# Altium schematic sheet Schematic_Rev3.1.SchDoc
size A3
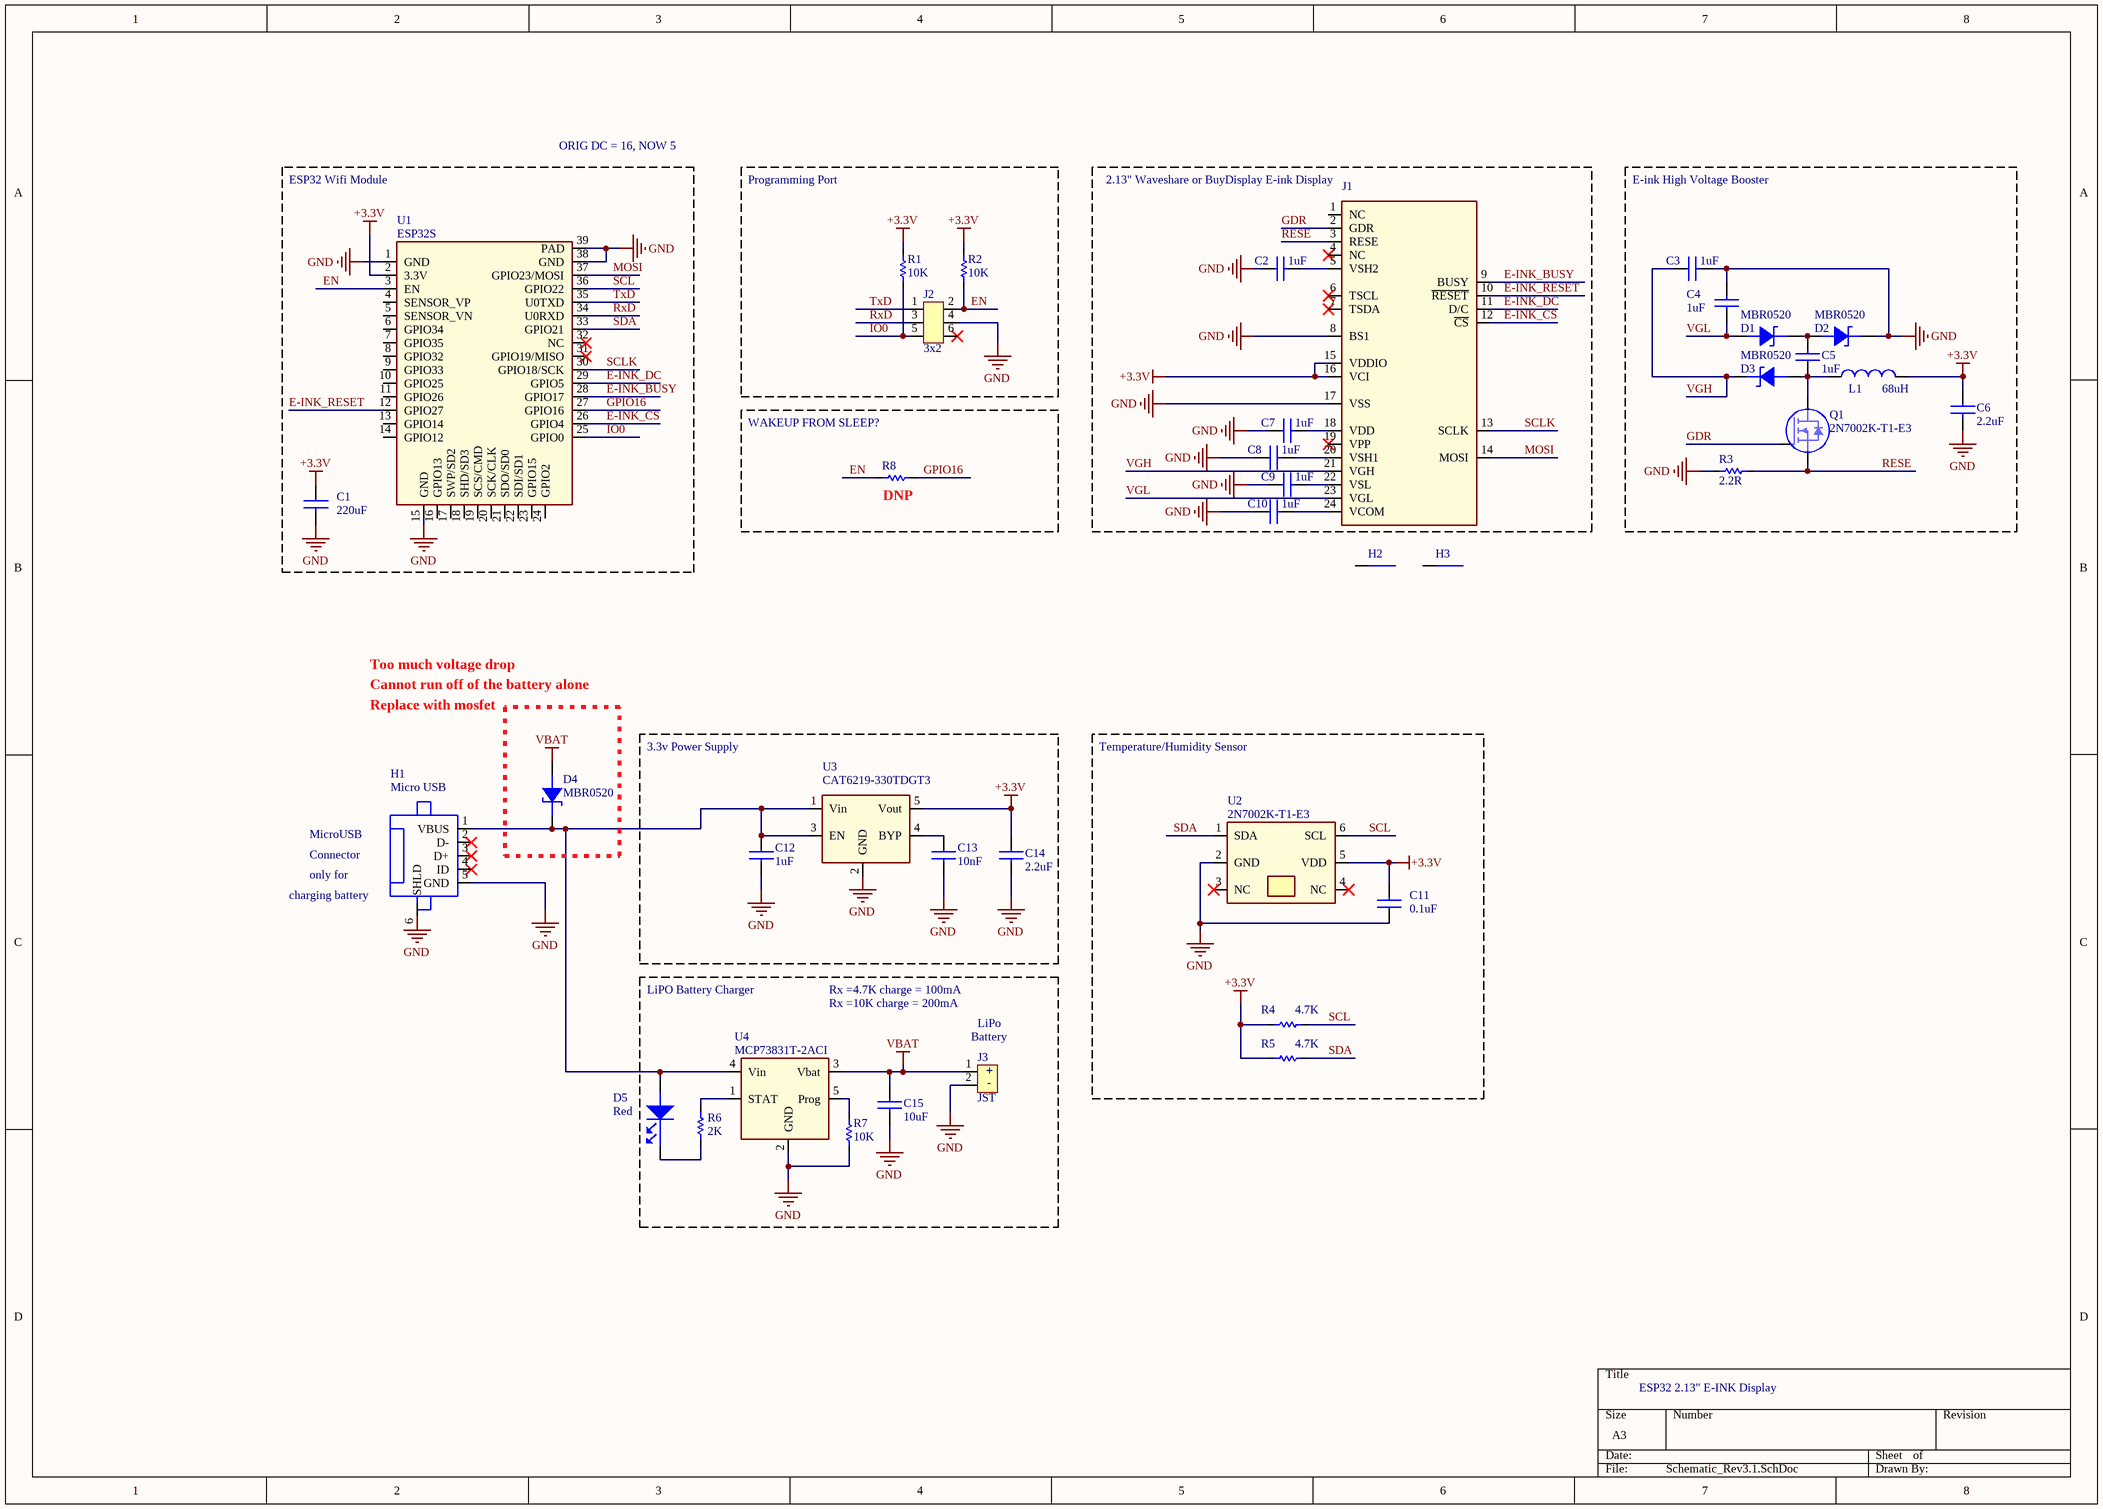
[diagram p0: Schematic_Rev3.1.SchDoc]

## Parts
C1  220uF  [CAPC3216X160N]
C2  1uF  [CAPC1608X09L]
C3  1uF  [CAPC1608X09L]
C4  1uF  [CAPC1608X09L]
C5  1uF  [CAPC1608X09L]
C6  2.2uF  [CAPC1608X09L]
C7  1uF  [CAPC1608X09L]
C8  1uF  [CAPC1608X09L]
C9  1uF  [CAPC1608X09L]
C10  1uF  [CAPC1608X09L]
C11  0.1uF  [CAPC1608X09L]
C12  1uF  [CAPC1608X09L]
C13  10nF  [CAPC1608X09L]
C14  2.2uF  [CAPC1608X09L]
C15  10uF  [CAPC3216X160L]
D1  value MBR0520  [SOD123]  (hidden comment: MBR0520-TP)
D2  value MBR0520  [SOD123]  (hidden comment: MBR0520-TP)
D3  value MBR0520  [SOD123]  (hidden comment: MBR0520-TP)
D4  value MBR0520  [SOD123]  (hidden comment: MBR0520-TP)
D5  value Red  [LED1608X55N-RED]  (hidden comment: LED_0603)
H1  Micro USB  [1981584-1]
H2  E-INK Display  (value not drawn)  (mechanical)
H3  E-INK Display  (value not drawn)  (mechanical)
J1  24POS Flex Con  [0524352471]  (value not drawn)
J2  3x2  [0872640652]
J3  JST  [S2B-PH-K-S]
L1  value 68uH  [LHQ43C]  (hidden comment: LQH43CN680K03L)
Q1  2N7002K-T1-E3  [SOT95P240X110-3N]
R1  10K  [RESC1608X06L]
R2  10K  [RESC1608X06L]
R3  2.2R  [RESC1608X06L]
R4  4.7K  [RESC1608X06L]
R5  4.7K  [RESC1608X06L]
R6  2K  [RESC1608X06L]
R7  10K  [RESC1608X06L]
R8  DNP  [RESC1608X06L]  (value not drawn)  (no BOM)
U1  ESP32s  [ESP32]
U2  PartNumber: 2N7002K-T1-E3  [S-PWSON-N6]  (hidden comment: HDC1080DMBT)
U3  CAT6219-330TDGT3  [SOT95P280X144-5N]
U4  value MCP73831T-2ACI  [SOT95P280X144-5N]  (hidden comment: MCP73831T-2ACI/OT)

## Blocks framed on the sheet
Programming Port: J2 R1 R2
2.13" Waveshare or BuyDisplay E-ink Display: C2 C7-C10 J1
E-ink High Voltage Booster: C3-C6 D1-D3 L1 Q1 R3
DNP: R8
3.3v Power Supply: C12-C14 U3
Temperature/Humidity Sensor: C11 R4 R5 U2

## Nets
+3.3V: C1.1 C6.1 C11.2 C14.1 J1.15(VDDIO) J1.16(VCI) L1.2 R1.1 R2.1 R4.2 R5.2 U1.2(3.3V) U2.5(VDD) U3.5(Vout)
GND: C1.2 C2.1 C3.2 C4.2 C6.2 C7.1 C8.1 C9.1 C10.1 C11.1 C12.2 C13.2 C14.2 C15.2 D2.1(Cathode) H1.5(GND) H1.6(SHLD) J1.8(BS1) J1.17(VSS) J2.4 J3.2 R3.1 R7.2 U1.1(GND) U1.15(GND) U1.38(GND) U1.39(PAD) U2.2(GND) U3.2(GND) U4.2(GND)
VBAT: C15.1 D4.2(Annode) J3.1 U4.3(Vbat)
E-INK_BUSY: J1.9(BUSY) U1.28(GPIO17)
E-INK_CS: J1.12(~{CS}) U1.26(GPIO4)
E-INK_DC: J1.11(D/C) U1.29(GPIO5)
E-INK_RESET: J1.10(~{RESET}) U1.12(GPIO27)
EN: J2.2 R2.2 R8.1 U1.3(EN)
GDR: J1.2(GDR) Q1.1(G)
GPIO16: R8.2 U1.27(GPIO16)
IO0: J2.5 R1.2 U1.25(GPIO0)
MOSI: J1.14(MOSI) U1.37(GPIO23/MOSI)
RESE: J1.3(RESE) Q1.2(S) R3.2
RxD: J2.3 U1.34(U0RXD)
SCL: R4.1 U1.36(GPIO22) U2.6(SCL)
SCLK: J1.13(SCLK) U1.30(GPIO18/SCK)
SDA: R5.1 U1.33(GPIO21) U2.1(SDA)
TxD: J2.1 U1.35(U0TXD)
VGH: C3.1 D3.1(Cathode) J1.21(VGH)
VGL: C4.1 D1.2(Annode) J1.23(VGL)
NetC2_2: C2.2 J1.5(VSH2)
NetC5_1: C5.1 D3.2(Annode) L1.1 Q1.3(D)
NetC5_2: C5.2 D1.1(Cathode) D2.2(Annode)
NetC7_2: C7.2 J1.18(VDD)
NetC8_2: C8.2 J1.20(VSH1)
NetC9_2: C9.2 J1.22(VSL)
NetC10_2: C10.2 J1.24(VCOM)
NetC12_1: C12.1 D4.1(Cathode) D5.2(ANODE) H1.1(VBUS) U3.1(Vin) U3.3(EN) U4.4(Vin)
NetC13_1: C13.1 U3.4(BYP)
NetD5_1: D5.1(CATHODE) R6.1
NetR6_2: R6.2 U4.1(STAT)
NetR7_1: R7.1 U4.5(Prog)

Not connected (* = marked no-connect by the designer): H1 2(D-)* 3(D+)* 4(ID)*; H2 ?1; H3 ?1; J1 1(NC) 4(NC)* 6(TSCL)* 7(TSDA)* 19(VPP)*; J2 6*; U1 4(SENSOR_VP) 5(SENSOR_VN) 6(GPIO34) 7(GPIO35) 8(GPIO32) 9(GPIO33) 10(GPIO25) 11(GPIO26) 13(GPIO14) 14(GPIO12) 16(GPIO13) 17(SWP/SD2) 18(SHD/SD3) 19(SCS/CMD) 20(SCK/CLK) 21(SDO/SD0) 22(SDI/SD1) 23(GPIO15) 24(GPIO2) 31(GPIO19/MISO)* 32(NC)*; U2 3(NC)* 4(NC)*

## Notes on the sheet
- ESP32 Wifi Module
- ORIG DC = 16, NOW 5
- (near R8) WAKEUP FROM SLEEP?
- Too much voltage drop
- Cannot run off of the battery alone
- Replace with mosfet
- MicroUSB
- (near H1) Connector
- (near H1) charging battery
- only for
- LiPO Battery Charger
- Rx =4.7K charge = 100mA
- Rx =10K charge = 200mA
- (near J3) Battery
- (near J3) LiPo
- ESP32 2.13" E-INK Display
- (in symbol S2B-PH-K-S(LF)(SN)) +; -

## Library data of the parts
C1 = CAP_1206: CAP CER 220UF 4V X6S 1206; PartNumber: GRM31CC80G227ME11L; Manufacturer: Murata; Vendor: Aliexpress; Value: 220uF; Price: 1.277; Link: https://www.aliexpress.com/item/New-original-ceramic-capacitors-0805-476K-47UF-10/32745080812.html?spm=2114.search0104.3.2.z4cG4F&ws_ab_test=searchweb0_0,searchweb201602_3_10152_10065_10151_10068_10130_5430020_5410020_10139_10307_10137_10060_10155_10154_5370011_10056_10055_10054_10059_100031_10099_5400020_10103_10102_10052_10053_10142_10107_10050_10051_5380020_5390020_10084_10083_10080_10082_10081_10178_10110_10111_5420020_10112_10113_10114_10312_10313_10314_10315_10078_10079_10073,searchweb201603_2,ppcSwitch_4&btsid=aa6cfec4-1d41-495d-987d-e865bb8479b9&algo_expid=b3fac57a-b89e-4950-a1ba-3a922014093b-0&algo_pvid=b3fac57a-b89e-4950-a1ba-3a922014093b&transAbTest=ae803_2
C2 C7-C10 C12 = CAP_0603: CAP CER 1uF 16V X7R 0603; PartNumber: GRM188R71C105KA12D; Manufacturer: Murata; Vendor: Digi-Key; Value: 1uF
C3 C5 = CAP_0603: CAP CER 1UF 25V X7R 0603; PartNumber: C0603C105K3RACTU; Manufacturer: Kemet; Vendor: Digi-Key; Value: 1uF
C4 = CAP_0603: CAP CER 1UF 25V X7R 0603; PartNumber: GRM188R71C105KA12D; Manufacturer: Kemet; Vendor: Digi-Key; Value: 1uF
C6 C14 = CAP_0805: CAP CER 2.2uF 16V X5R 0603; Manufacturer: Murata; PartNumber: GRM188R61C225KE15D; Vendor: Digi-Key; Value: 2.2uF
C11 = CAP_0603: CAP, 0.1uF, 25V, 0603; PartNumber: GRM188R71E104KA01D; Manufacturer: Murata; Vendor: Digi-Key; Value: 0.1uF
C13 = CAP_0603: CAP CER 0.01uF 16V X7R 0603; PartNumber: GRM188R71C103KA01D; Manufacturer: Murata; Vendor: Digi-Key; Value: 10nF
C15 = CAP_1206: CAP CER 10uF 16V 10% X7R 1206; PartNumber: CL31B106KOHNNNE; Manufacturer: Samsung; Vendor: Digi-Key; Value: 10uF
D1-D4 = MBR0520-TP: DIODE SCHOTTKY 20V 500MA SOD123; Manufacturer: Micro; Vendor: Digi-Key; PartNumber: MBR0520-TP; Link: https://www.aliexpress.com/item/50pcs-MBR0520LT1G-SOD123-MBR0520-SOD-marking-B2-new-original-free-shipping/32819384431.html?spm=2114.search0104.3.9.hHyhvv&ws_ab_test=searchweb0_0,searchweb201602_3_10152_10065_10151_10068_10130_5410020_10139_10307_10137_10060_10155_10154_5370011_10056_10055_10054_10059_100031_10099_5400020_10103_10102_5430011_10052_10053_10142_10107_10050_10051_5380020_5390020_10084_10083_10080_10082_10081_10178_10110_10111_5420020_10112_10113_10114_10312_10313_10314_10315_10078_10079_10073,searchweb201603_2,ppcSwitch_4&btsid=5077460b-7934-4e65-a393-1337eef77f03&algo_expid=113b291d-3ce1-4421-a189-917108d206e2-1&algo_pvid=113b291d-3ce1-4421-a189-917108d206e2&transAbTest=ae803_2; Price: 0.038
D5 = LED_0603: LED RED CLEAR 0603 SMD; Manufacturer: Lite-On; PartNumber: LTST-C191KRKT; Vendor: Digi-Key
H1 = 1981584-1: CONN RCPT MICRO USB TYPE AB; Manufacturer: TE Connectivity; Vendor: Digi-Key; PartNumber: 1981584-1; Value: Micro USB
H2 = BOM_ITEM: BuyDisplay 2.13" E-INK Display; PartNumber: ER-EPD0213-1; Value: 2.13" E-INK Display; Manufacturer: BuyDisplay; Vendor: BuyDisplay
H3 = BOM_ITEM: WaveShare 2.13" E-INK Display; PartNumber: 13368; Value: 2.13" E-INK Display; Manufacturer: WaveShare; Vendor: WaveShare
J1 = 0524352471: CONN FFC TOP 24POS 0.50MM R/A; Manufacturer: Molex; Vendor: Digi-Key; PartNumber: 0524352471; Value: 24POS Flex Con
J2 = 0872640652: Recptacle, Female 3X2,TH, 2MM R/A; Manufacturer: MOLEX; Vendor: Digi-Key; Value: 3x2 Female Con; PartNumber: 0872640652
J3 = S2B-PH-K-S(LF)(SN): CONN HEADER PH SIDE 2POS 2MM; Value: Batt Connector; Vendor: Digi-Key; PartNumber: S2B-PH-K-S(LF)(SN); Manufacturer: JST
L1 = LQH43CN680K03L: INDUCTOR 68UH 10% 220MA 1812; Manufacturer: Murata; Vendor: Digi-Key; PartNumber: LQH43CN680K03L
Q1 = 2N7002K-T1-E3: MOSFET N-CH 60V 300MA SOT-23; Manufacturer: Vishay Siliconix; Vendor: Digi-Key; Value: N-CH Mosfet; PartNumber: 2N7002K-T1-E3
R1 R2 R7 = RES_0603: RES SMD 10K OHM 1% 1/10W 0603; Manufacturer: Panasonic; PartNumber: ERJ-3EKF1002V; Vendor: Digi-Key; Value: 10K
R3 = RES_0603: RES SMD 2.2 OHM 5% 1/10W 0603; Manufacturer: Panasonic; PartNumber: ERJ-3GEYJ2R2V; Vendor: Digi-Key; Value: 2.2R
R4 R5 = RES_0603: RES SMD 4.7K OHM 1% 1/4W 0603; Manufacturer: Panasonic; PartNumber: ERJ-PA3F4701V; Vendor: Digi-Key; Value: 4.7K
R6 = RES_0603: RES SMD 2K OHM 1% 1/10W 0603; Manufacturer: Panasonic; PartNumber: ERJ-3EKF2001V; Vendor: Digi-Key; Value: 2K
R8 = RES_0603: RES 0603
U1 = ESP32: WIFI&Bluetooth; Maufacturer: Espressif; Vendor: Alexpress; Value: ESP32; PartNumber: ESP32S
U2 = HDC1080DMBT: Humidity/Temperature Sensor; Manufacturer: Texas Instruments; Vendor: Digi-Key; Value: 2N7002K-T1-E3
U3 = CAT6219-330TDGT3: IC REG LDO 3.3V 0.5A SOT23-5; Manufacturer: On Semi; Vendor: Digi-Key; PartNumber: CAT6219-330TDGT3; Value: CAT6219-330TDGT3
U4 = MCP73831T-2ACI/OT: Charger IC Lithium-Ion/Polymer SOT23-5; Manufacturer: Microchip; Vendor: Digi-Key; PartNumber: MCP73831T-2ACI/OT